# Altium schematic sheet ZUM_Core_USB_BT.SchDoc: ZUM Core USB BT
size A4; Author: Andrés Gullón; DocumentNumber: 7; SheetNumber: 7; SheetTotal: 9
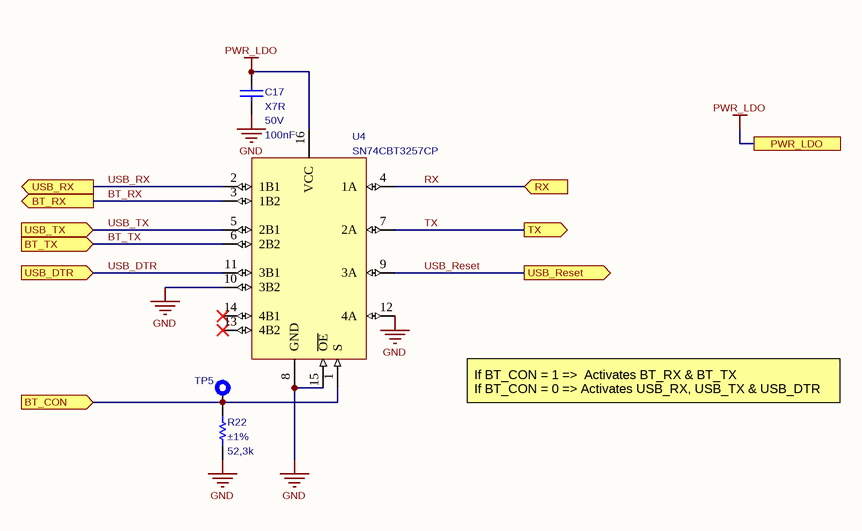
[diagram p0: ZUM_Core_USB_BT.SchDoc]

## Parts
C17  Dielectric: X7R  Voltage: 50V  Capacitance: 100nF  [C0603]  (hidden comment: C0603_100nF_50V_±10%_X7R)
R22  Tolerance: ±1%  Resistance: 52,3k  [R0402]  (hidden comment: R0402_52,3k_0.063W_±1%)
TP5  TP  [TP_POWER]  (value not drawn)  (no BOM)
U4  SN74CBT3257CP  [TSSOP16]

## Ports
BT_CON (in), BT_RX (out), BT_TX (in), PWR_LDO, RX (in), TX (out), USB_DTR (in), USB_Reset (out), USB_RX (out), USB_TX (in)

## Nets
GND: C17.1 R22.2 U4.8(GND) U4.10(3B2) U4.12(4A) U4.15(~{OE})
PWR_LDO: C17.2 U4.16(VCC) ; port PWR_LDO
BT_CON: R22.1 TP5.1 U4.1(S) ; port BT_CON
BT_RX: U4.3(1B2) ; port BT_RX
BT_TX: U4.6(2B2) ; port BT_TX
RX: U4.4(1A) ; port RX
TX: U4.7(2A) ; port TX
USB_DTR: U4.11(3B1) ; port USB_DTR
USB_Reset: U4.9(3A) ; port USB_Reset
USB_RX: U4.2(1B1) ; port USB_RX
USB_TX: U4.5(2B1) ; port USB_TX

Not connected (* = marked no-connect by the designer): U4 13(4B2)* 14(4B1)*

## Notes on the sheet
- If BT_CON = 1 =>  Activates BT_RX & BT_TX
  If BT_CON = 0 => Activates USB_RX, USB_TX & USB_DTR
- Title
- Project
- Size:
- Author
- A4
- Number:
- Revision:
- Mundo Reader, S.L. This project and all the sheets and layouts enclosed are licensed under Creative Commons by Attribution and Share Alike [CC BY-SA] (www.creativecommons.com)
- Date:
- Time:
- Sheet
- of

## Library data of the parts
C17 = CMP-00257-1: Manufacturer: Kemet; Description ES: Condensador; OrderingCode: C0603C104K5RAC; OrderingCode 2: 06035C104KAT2A; SchLibComponentName: Capacitor; Temp_ Max: 125; Temp_ Min: -55; Tolerance: ±10%; Value: 100nF ±10% 50V; Manufacturer 2: AVX; Part Number: C0603_100nF_50V_±10%_X7R; Price units: EUR
R22 = CMP-A1961-1: Manufacturer: Vishay; Value: 52,3k ±1% 0.063W; OrderingCode: CRCW040252K3FK; Power: 0.063W; Temp_ Max: 155; Temp_ Min: -55; SchLibComponentName: Resistor; PackageDescription: SMD; Part Number: R0402_52,3k_0.063W_±1%; Price units: EUR
TP5 = CMP-A2499-3: Testpoint 0.3mm; Manufacturer: Oxley; OrderingCode: SMOX/060/B1; SAP: 303552; SchLibComponentName: Testpoint; Part Number: TP_POWER; Price units: EUR
U4 = CMP-A2334-1: Multiplexer; Manufacturer: Texas Instruments; OrderingCode: SN74CBT3257CPWR; Description ES: Multiplexador; Temp_ Max: 85; Temp_ Min: -40; Lead time: 6 wks; SchLibComponentName: SN74CBT3257; Part Number: SN74CBT3257CP; Supplier: Silica; Supplier cod: AC1190; Price: 0,192; Price units: EUR; HelpURL: https://openkm-usa.bq.com/OpenKM/index.jsp?uuid=ee2e39d9-8b20-4e62-b4a8-b54acf89f69a